# EAGLE design MiSTer_LLOAD_DIY_Edition (EAGLE 6.6.0)
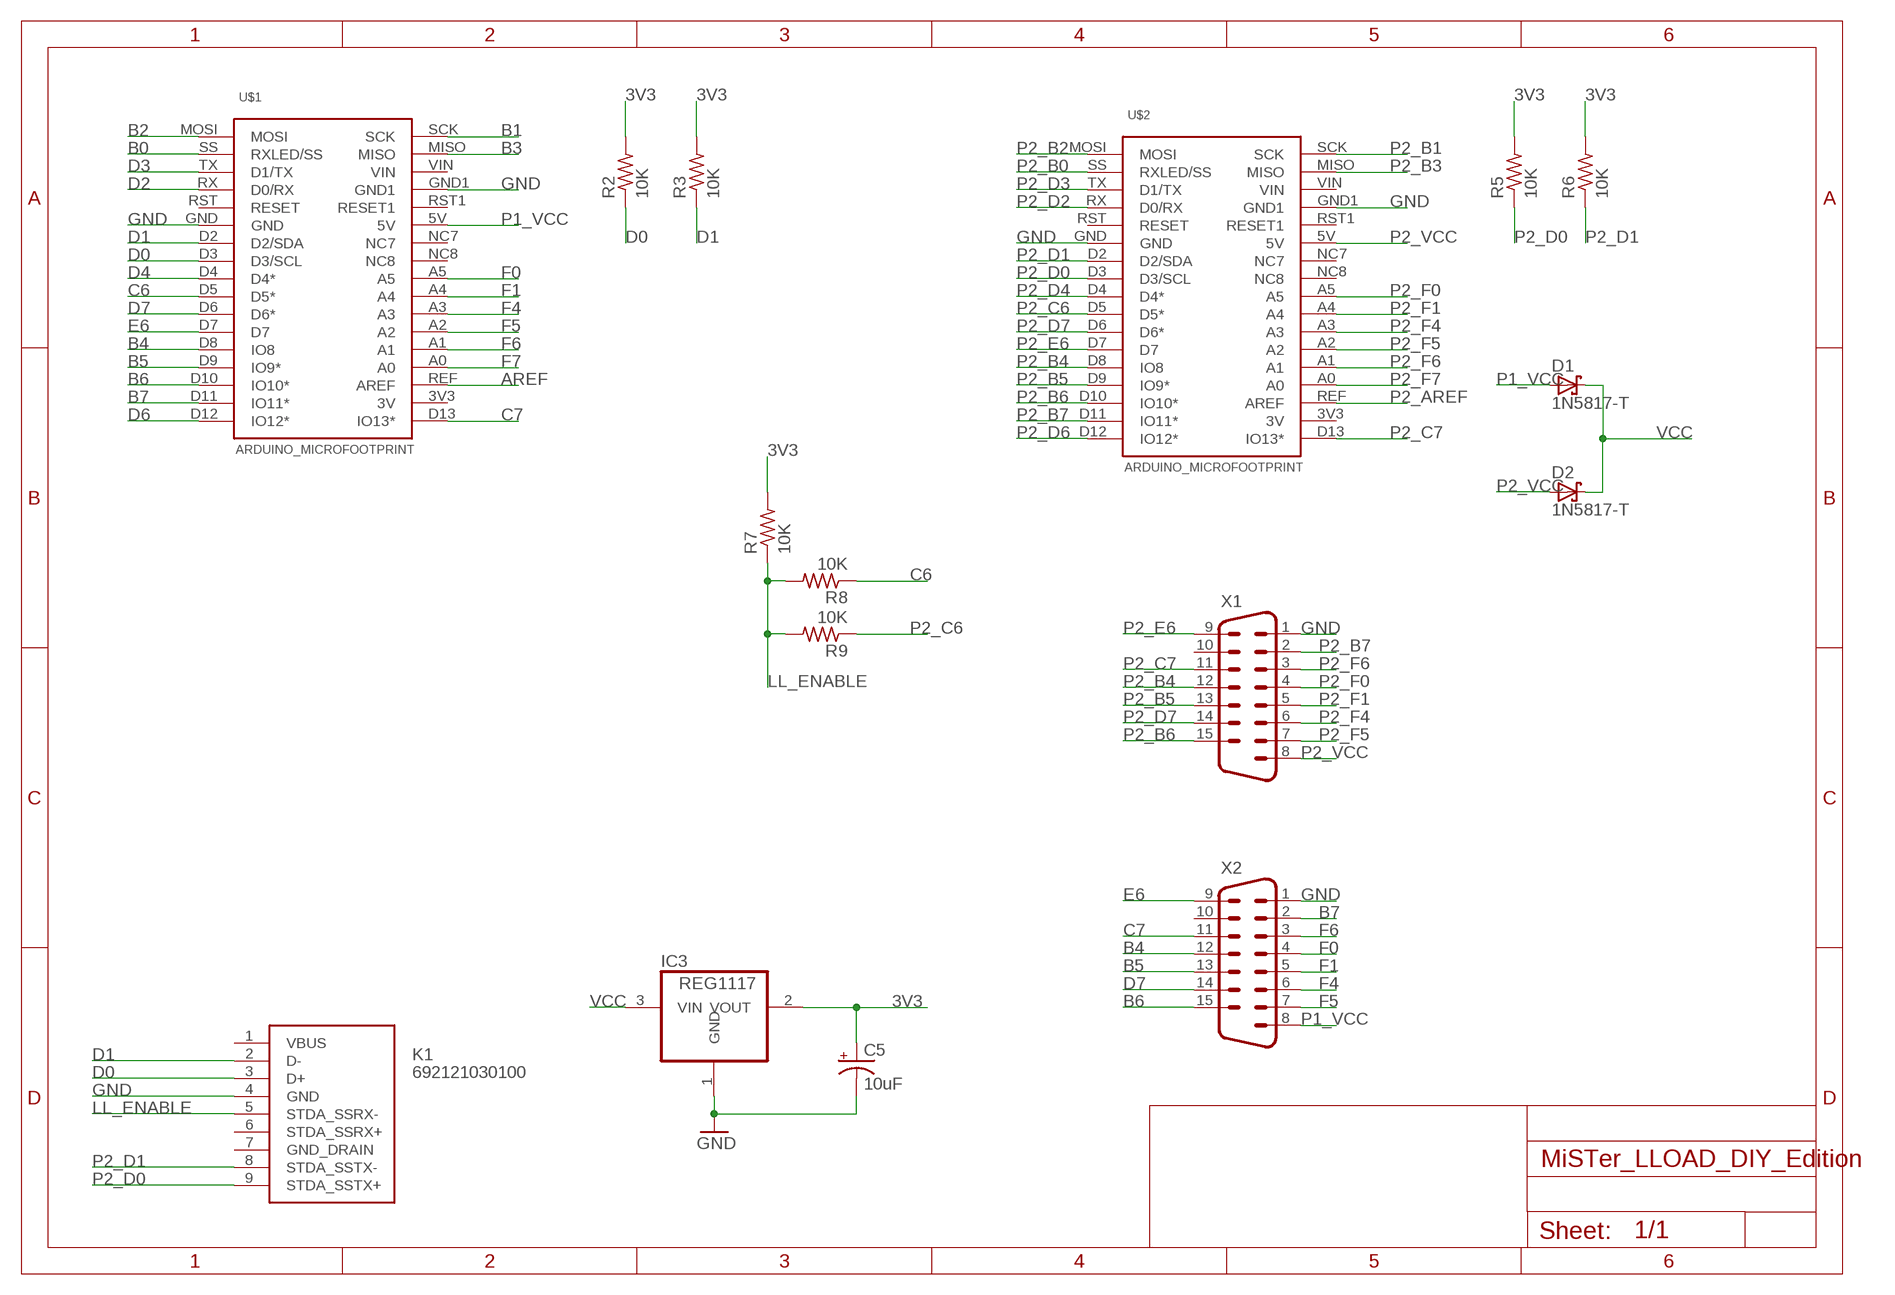
[diagram p0: schematic, sheet 1]

## Parts
C5  10uF  CPOL-USE2.5-6  [E2,5-6]
D1  1N5817-T  [DO41-7.6]
D2  1N5817-T  [DO41-7.6]
IC3  REG1117  [SOT223]
K1  692121030100  [692121030100]
R2  10K  R-US_0207/10  [0207/10]
R3  10K  R-US_0207/10  [0207/10]
R5  10K  R-US_0207/10  [0207/10]
R6  10K  R-US_0207/10  [0207/10]
R7  10K  R-US_0207/10  [0207/10]
R8  10K  R-US_0207/10  [0207/10]
R9  10K  R-US_0207/10  [0207/10]
U$1  ARDUINO_MICROFOOTPRINT  [ARDUINO-MICRO]
U$2  ARDUINO_MICROFOOTPRINT  [ARDUINO-MICRO]
X1  M15HP  [M15HP]
X2  M15HP  [M15HP]

## Nets
3V3: C5.+ IC3.2(VOUT) R2.2 R3.2 R5.2 R6.2 R7.2
AREF: U$1.REF(AREF)
B0: U$1.SS(RXLED/SS)
B1: U$1.SCK
B2: U$1.MOSI
B3: U$1.MISO
B4: U$1.D8(IO8) X2.12
B5: U$1.D9(IO9*) X2.13
B6: U$1.D10(IO10*) X2.15
B7: U$1.D11(IO11*) X2.2
C6: R8.1 U$1.D5(D5*)
C7: U$1.D13(IO13*) X2.11
D0: K1.3(D+) R2.1 U$1.D3(D3/SCL)
D1: K1.2(D-) R3.1 U$1.D2(D2/SDA)
D2: U$1.RX(D0/RX)
D3: U$1.TX(D1/TX)
D4: U$1.D4(D4*)
D6: U$1.D12(IO12*)
D7: U$1.D6(D6*) X2.14
E6: U$1.D7 X2.9
F0: U$1.A5 X2.4
F1: U$1.A4 X2.5
F4: U$1.A3 X2.6
F5: U$1.A2 X2.7
F6: U$1.A1 X2.3
F7: U$1.A0
GND: C5.- IC3.1(GND) K1.4(GND) U$1.GND U$1.GND1 U$2.GND U$2.GND1 X1.1 X2.1
LL_ENABLE: K1.5(STDA_SSRX-) R7.1 R8.2 R9.2
P1_VCC: D1.A U$1.5V X2.8
P2_AREF: U$2.REF(AREF)
P2_B0: U$2.SS(RXLED/SS)
P2_B1: U$2.SCK
P2_B2: U$2.MOSI
P2_B3: U$2.MISO
P2_B4: U$2.D8(IO8) X1.12
P2_B5: U$2.D9(IO9*) X1.13
P2_B6: U$2.D10(IO10*) X1.15
P2_B7: U$2.D11(IO11*) X1.2
P2_C6: R9.1 U$2.D5(D5*)
P2_C7: U$2.D13(IO13*) X1.11
P2_D0: K1.9(STDA_SSTX+) R5.1 U$2.D3(D3/SCL)
P2_D1: K1.8(STDA_SSTX-) R6.1 U$2.D2(D2/SDA)
P2_D2: U$2.RX(D0/RX)
P2_D3: U$2.TX(D1/TX)
P2_D4: U$2.D4(D4*)
P2_D6: U$2.D12(IO12*)
P2_D7: U$2.D6(D6*) X1.14
P2_E6: U$2.D7 X1.9
P2_F0: U$2.A5 X1.4
P2_F1: U$2.A4 X1.5
P2_F4: U$2.A3 X1.6
P2_F5: U$2.A2 X1.7
P2_F6: U$2.A1 X1.3
P2_F7: U$2.A0
P2_VCC: D2.A U$2.5V X1.8
VCC: D1.C D2.C IC3.3(VIN)
Unconnected: K1.1(VBUS) K1.6(STDA_SSRX+) K1.7(GND_DRAIN) U$1.3V3(3V) U$1.NC7 U$1.NC8 U$1.RST1(RESET1) U$1.RST(RESET) U$1.VIN U$2.3V3(3V) U$2.NC7 U$2.NC8 U$2.RST1(RESET1) U$2.RST(RESET) U$2.VIN X1.10 X2.10

## Library data of the parts
C5 = rcl:CPOL-US: POLARIZED CAPACITOR, American symbol
D1 D2 = diode:1N581*: 1.0A SCHOTTKY BARRIER RECTIFIER Source: http://www.diodes.com/datasheets/ds23001.pdf
IC3 = burr-brown:REG1117: 800mA and 1A Low Dropout (LDO) Positive Regulator 1.8V, 2.5V, 2.85V, 3.3V, 5V, and Adj; MPN: REG1117; OC_FARNELL: 1097566; OC_NEWARK: 14P6981
K1 = wuerth:692121030100: WR-COM USB 3.0 HORIZONTAL TYPE A
R2 R3 R5-R9 = rcl:R-US_: RESISTOR, American symbol
U$1 U$2 = arduino-micro:ARDUINO_MICRO
X1 X2 = con-subd:M15: SUB-D; OC_FARNELL: unknown; OC_NEWARK: unknown

## Board
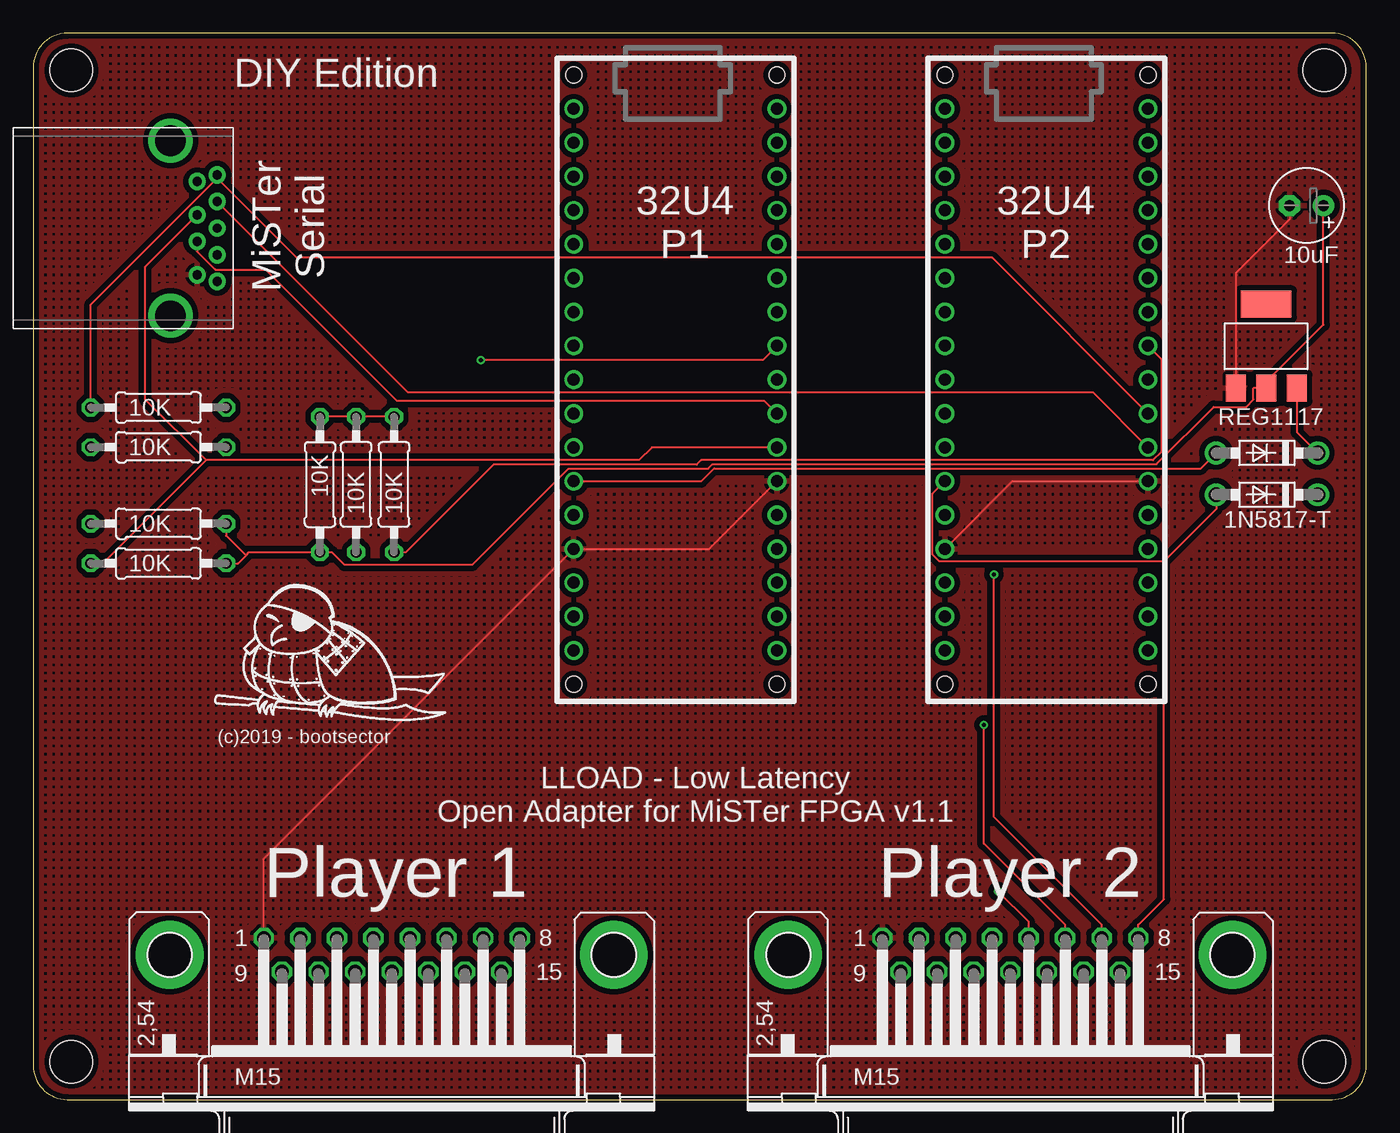
[diagram p1: board, top side]
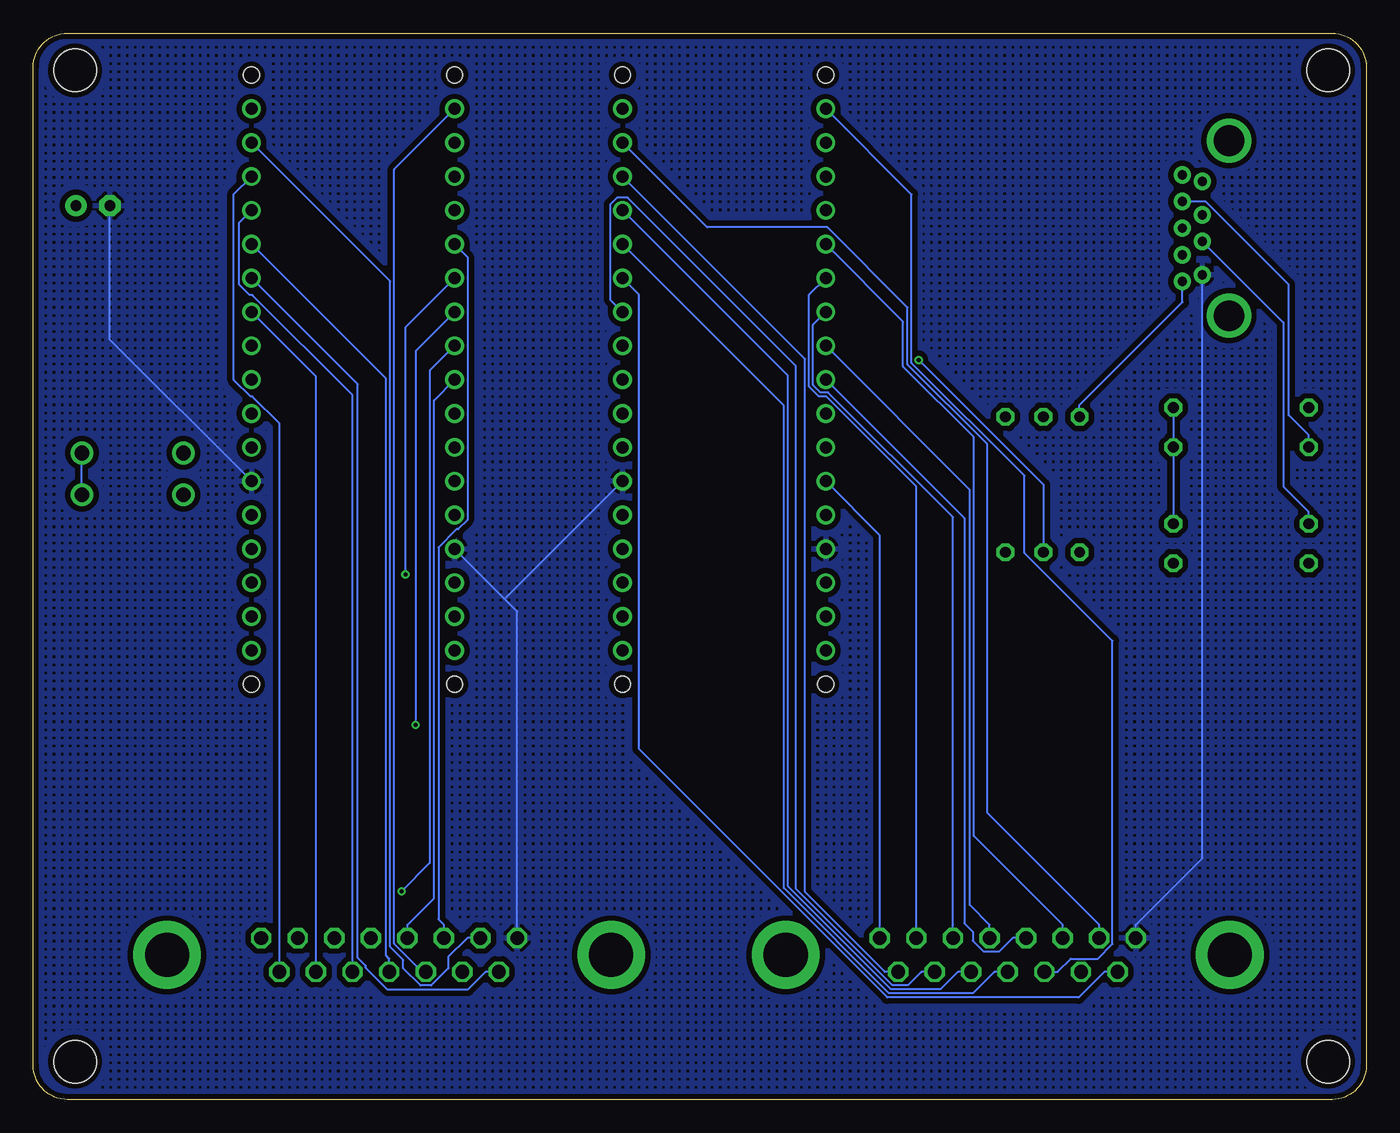
[diagram p2: board, bottom side, seen from below]

Size 100 x 80 mm. Coordinates in mm from the lower left corner, seen from the top.
Outline: 0,77.46 0,2.54 arc90 2.54,0 97.46,0 arc90 100,2.54 100,77.46 arc90 97.46,80 2.54,80 arc90 0,77.46
Copper layers (1*16): Top 0.035mm / dielectric 1.5mm / Bottom 0.035mm
Design rules "SeeedStudio_2layer_DRU_no_angle_20140221": minimum track width 6mil, minimum drill 12mil, track to track 6mil, track to pad 6mil, pad to pad 6mil, via to via 6mil, smd to smd 0mil, copper to edge 10mil, drill to drill 10mil, minimum pad ring 10mil, minimum via ring 6mil, stop-mask expansion 2mil, vias tented up to drill 100mil, thermal gap 10mil
Holes 3.2 mm at 2.85,77.22 2.85,2.85 96.87,2.85 96.87,77.22

### Footprints (pad centres in the part's own frame; a part is rotated, then mirrored left to right if it is on the bottom)
E2,5-6 = drill 0.813 pad 1.6: + -1.27,0 | drill 0.813 pad 1.6 octagon: - 1.27,0
DO41-7.6 = drill 1.1 pad 1.7: A 3.81,0; C -3.81,0
SOT223 = smd 1.499 x 2.007: 1 -2.261,-3.15; 2 0.025,-3.15; 3 2.311,-3.15 | smd 3.81 x 2.007: 4 0,3.15
692121030100 = drill 0.7 pad 1.3: 1 3.5,1.5; 2 1,1.5; 3 -1,1.5; 4 -3.5,1.5; 5 -4,0; 6 -2,0; 7 0,0; 8 2,0; 9 4,0 | drill 2.3 pad 3.3: Z1 -6.57,3.5; Z2 6.57,3.5
0207/10 = drill 0.813 octagon: 1 -5.08,0; 2 5.08,0
ARDUINO-MICRO = drill 0.9: 3V3 16.51,3.81; 5V 16.51,29.21; A0 16.51,8.89; A1 16.51,11.43; A2 16.51,13.97; A3 16.51,16.51; A4 16.51,19.05; A5 16.51,21.59; D2 1.27,26.67; D3 1.27,24.13; D4 1.27,21.59; D5 1.27,19.05; D6 1.27,16.51; D7 1.27,13.97; D8 1.27,11.43; D9 1.27,8.89; D10 1.27,6.35; D11 1.27,3.81; D12 1.27,1.27; D13 16.51,1.27; GND 1.27,29.21; GND1 16.51,34.29; MISO 16.51,39.37; MOSI 1.27,41.91; NC7 16.51,26.67; NC8 16.51,24.13; REF 16.51,6.35; RST 1.27,31.75; RST1 16.51,31.75; RX 1.27,34.29; SCK 16.51,41.91; SS 1.27,39.37; TX 1.27,36.83; VIN 16.51,36.83 | hole 1.2: 1.27,-1.27; 16.51,-1.27; 1.27,44.45; 16.51,44.45
M15HP = drill 1.016 octagon: 1 -9.601,1.27; 2 -6.858,1.27; 3 -4.115,1.27; 4 -1.372,1.27; 5 1.372,1.27; 6 4.115,1.27; 7 6.858,1.27; 8 9.601,1.27; 9 -8.23,-1.27; 10 -5.486,-1.27; 11 -2.743,-1.27; 12 0,-1.27; 13 2.743,-1.27; 14 5.486,-1.27; 15 8.23,-1.27 | drill 3.302 pad 5.08: G1 -16.662,0; G2 16.662,0

### Placement (x,y rotation side)
C5  95.52,67.07 180 top
D1  92.55,48.51 180 top
D2  92.55,45.38 180 top
IC3  92.49,56.53 0 top
K1  13.79,65.38 90 top
R2  9.39,43.21 0 top
R3  9.39,40.23 0 top
R5  9.39,51.92 0 top
R6  9.39,48.95 0 top
R7  21.5,46.15 270 top
R8  24.22,46.15 90 top
R9  27.07,46.15 90 top
U$1  57.06,75.61 180 top
U$2  84.9,75.61 180 top
X1  73.3,10.85 0 top
X2  26.89,10.85 0 top

### Tracks (layer width: path | path; a pad name or v marks a point on that pad's centre or on a via)
3V3
  Top 0.152: 92.03,53.38 96.79,58.14 C5.+ | 92.03,53.38 91.54,53.38 91.54,52.52 90.99,51.97 88.56,51.97 84.26,47.67 50.96,47.67 50.62,47.33 40.15,47.33 32.95,40.13 23.33,40.13 22.39,41.07 R7.2 16.19,41.07 15.95,40.83 | IC3.2 92.03,53.38 | 15.95,40.83 15.36,40.23 R3.2 | 15.95,40.83 14.47,42.32 R2.2
  Bottom 0.152: R2.2 R6.2 R5.2
B4
  Bottom 0.152: U$1.D8 43.7,52.09 43.7,15.88 35.79,7.97 29.49,7.97 27.88,9.58 X2.12
B5
  Bottom 0.152: U$1.D9 43.39,54.32 43.39,16 35.67,8.28 31.93,8.28 30.62,9.58 X2.13
B6
  Bottom 0.152: U$1.D10 42.1,55.57 42.1,15.58 36.11,9.58 X2.15
B7
  Bottom 0.152: U$1.D11 49.44,65.45 40.43,65.45 34.41,59.43 34.41,55.15 28.43,49.17 28.43,21.52 20.03,13.11 X2.2
C6  (via drill 0.3 pad 0.61)
  Top 0.152: U$1.D5 54.73,55.49 v33.57,55.49
  Bottom 0.152: v33.57,55.49 24.22,46.13 R8.1
C7
  Bottom 0.152: U$1.D13 34.11,67.89 34.11,55.27 25.64,46.8 25.64,41.02 19.03,34.41 19.03,11.67 20.13,10.57 22.16,10.57 23.15,9.58 X2.11
D0
  Top 0.152: K1.3 12.29,63.63 13.65,62.27 17.43,62.27 27.26,52.44 54.82,52.44 U$1.D3
  Bottom 0.152: R2.1 4.31,44.09 6.21,46 6.21,58.3 K1.3
D1
  Top 0.152: 12.95,47.99 5.2,40.23 R3.1 | U$1.D2 46.41,48.94 45.46,47.99 12.95,47.99 | 12.95,47.99 8.4,52.54 8.4,62.49 K1.2
D7
  Bottom 0.152: U$1.D6 56.72,60.03 56.72,67.15 56.2,67.67 55.41,67.67 42.78,55.04 42.78,15.82 35.54,8.58 34.37,8.58 33.37,9.58 X2.14
E6
  Bottom 0.152: U$1.D7 54.56,60.41 54.56,26.31 35.92,7.67 21.56,7.67 19.65,9.58 X2.9
F0
  Bottom 0.152: U$1.A5 30.16,43.62 30.16,13.22 29.52,12.59 29.52,11.92 28.7,11.1 27.53,11.1 26.51,12.12 X2.4
F1
  Bottom 0.152: X2.5 28.26,13.11 29.74,14.59 29.74,45.75 U$1.A4
F4
  Bottom 0.152: X2.6 31,13.11 31,43.69 40.37,53.06 40.93,53.06 41.49,53.62 41.49,58.15 U$1.A3
F5
  Bottom 0.152: X2.7 33.75,46 40.5,52.75 41.05,52.75 41.8,53.49 41.8,60.38 U$1.A2
F6
  Bottom 0.152: U$1.A1 34.74,58.37 34.74,55.01 29.43,49.7 29.43,19.77 22.77,13.11 X2.3
GND
  Top 0.152: U$2.GND1 73.47,46.4 U$2.GND | C5.- 94.25,66.04 90.23,62.02 IC3.1 | U$1.GND 50.71,41.32 U$1.GND1 17.29,18.05 X2.1
  Bottom 0.152: U$2.GND 94.25,57.02 C5.- | 64.63,37.55 U$2.GND1 | X1.1 63.7,36.63 64.63,37.55 | U$1.GND 64.63,37.55 | X2.1 17.29,13.11 12.29,18.11 K1.4
  pour Bottom (isolate 0.406, hatched): -0.15,79.93 100.37,79.93 100.37,0.15 -0.15,0.15
  pour Top (isolate 0.406, hatched): -0.15,80.19 100.49,80.19 100.49,0.15 -0.15,0.15
LL_ENABLE
  Top 0.152: R7.1 R8.2 R9.2
  Bottom 0.152: R7.1 21.5,52.12 13.79,59.83 K1.5
P1_VCC
  Top 0.152: U$1.5V 50.12,46.4 51.08,47.36 87.59,47.36 D1.A
  Bottom 0.152: X2.8 36.49,42.34 U$1.5V
P2_B4
  Bottom 0.152: U$2.D8 73.53,54.08 73.53,10.8 73.3,10.57 X1.12
P2_B5
  Bottom 0.152: U$2.D9 84.57,65.78 84.57,61.15 83.78,60.37 83.57,60.37 76.05,52.84 76.05,10.57 X1.13
P2_B6
  Bottom 0.152: X1.15 81.53,50.7 83.58,52.75 83.7,52.75 84.95,53.99 84.95,67.94 U$2.D10
P2_B7
  Bottom 0.152: U$2.D11 73.23,61.39 73.23,11.46 72.24,10.46 72.24,9.85 70.95,8.56 70.14,8.56 68.87,9.84 68.87,10.69 67.44,12.12 X1.2
P2_C6
  Top 0.152: U$2.D5 84.62,55.57 84.62,48.59 84,47.97 50.1,47.97 49.77,47.63 34.52,47.63 27.95,41.07 R9.1
P2_C7
  Bottom 0.152: X1.11 70.81,9.58 72.92,11.69 72.92,69.8 U$2.D13
P2_D0
  Top 0.152: 13.79,69.14 K1.9 | R5.1 4.31,59.65 13.79,69.14 | U$2.D3 71.95,63.16 19.77,63.16 13.79,69.14
P2_D1
  Top 0.152: U$2.D2 79.52,53.05 28.12,53.05 K1.8
  Bottom 0.152: K1.8 12.04,67.38 5.81,61.15 5.81,51.34 4.31,49.84 R6.1
P2_D7
  Bottom 0.152: X1.14 78.79,54.25 U$2.D6
P2_E6
  Bottom 0.152: X1.9 66.07,9.58 67.4,8.24 73.41,8.24 75.06,9.9 75.06,10.04 75.67,10.65 75.67,53.67 U$2.D7
P2_F0
  Bottom 0.152: X1.4 71.93,13.11 69.95,15.1 69.95,52.46 U$2.A5
P2_F1  (via drill 0.3 pad 0.61)
  Top 0.152: X1.5 74.68,13.33 v72.37,15.63
  Bottom 0.152: U$2.A4 70.25,54.69 70.25,17.75 v72.37,15.63
P2_F4  (via drill 0.3 pad 0.61)
  Top 0.152: X1.6 77.42,13.11 71.32,19.21 v71.32,28.12
  Bottom 0.152: U$2.A3 71.32,56.17 v71.32,28.12
P2_F5  (via drill 0.3 pad 0.61)
  Top 0.152: X1.7 80.16,13.11 72.08,21.19 v72.08,39.38
  Bottom 0.152: v72.08,39.38 72.08,57.94 U$2.A2
P2_F6
  Bottom 0.152: U$2.A1 67.44,63.22 67.44,43.49 68.13,42.8 68.23,42.8 69.6,41.43 69.6,13.52 69.19,13.11 X1.3
P2_VCC
  Top 0.152: 84.82,40.37 68,40.37 67.46,40.91 67.46,45.46 U$2.5V | D2.A 88.74,44.29 84.82,40.37 | 84.82,40.37 84.82,15.03 82.91,13.11 X1.8
VCC
  Top 0.152: IC3.3 94.8,50.07 D1.C
  Bottom 0.152: D2.C D1.C

### Text on the board
tPlace: DIY Edition | MiSTer / Serial | 32U4 / P1 | 32U4 / P2 | (c)2019 - bootsector | LLOAD - Low Latency / Open Adapter for MiSTer FPGA v1.1 | Player 1 | Player 2